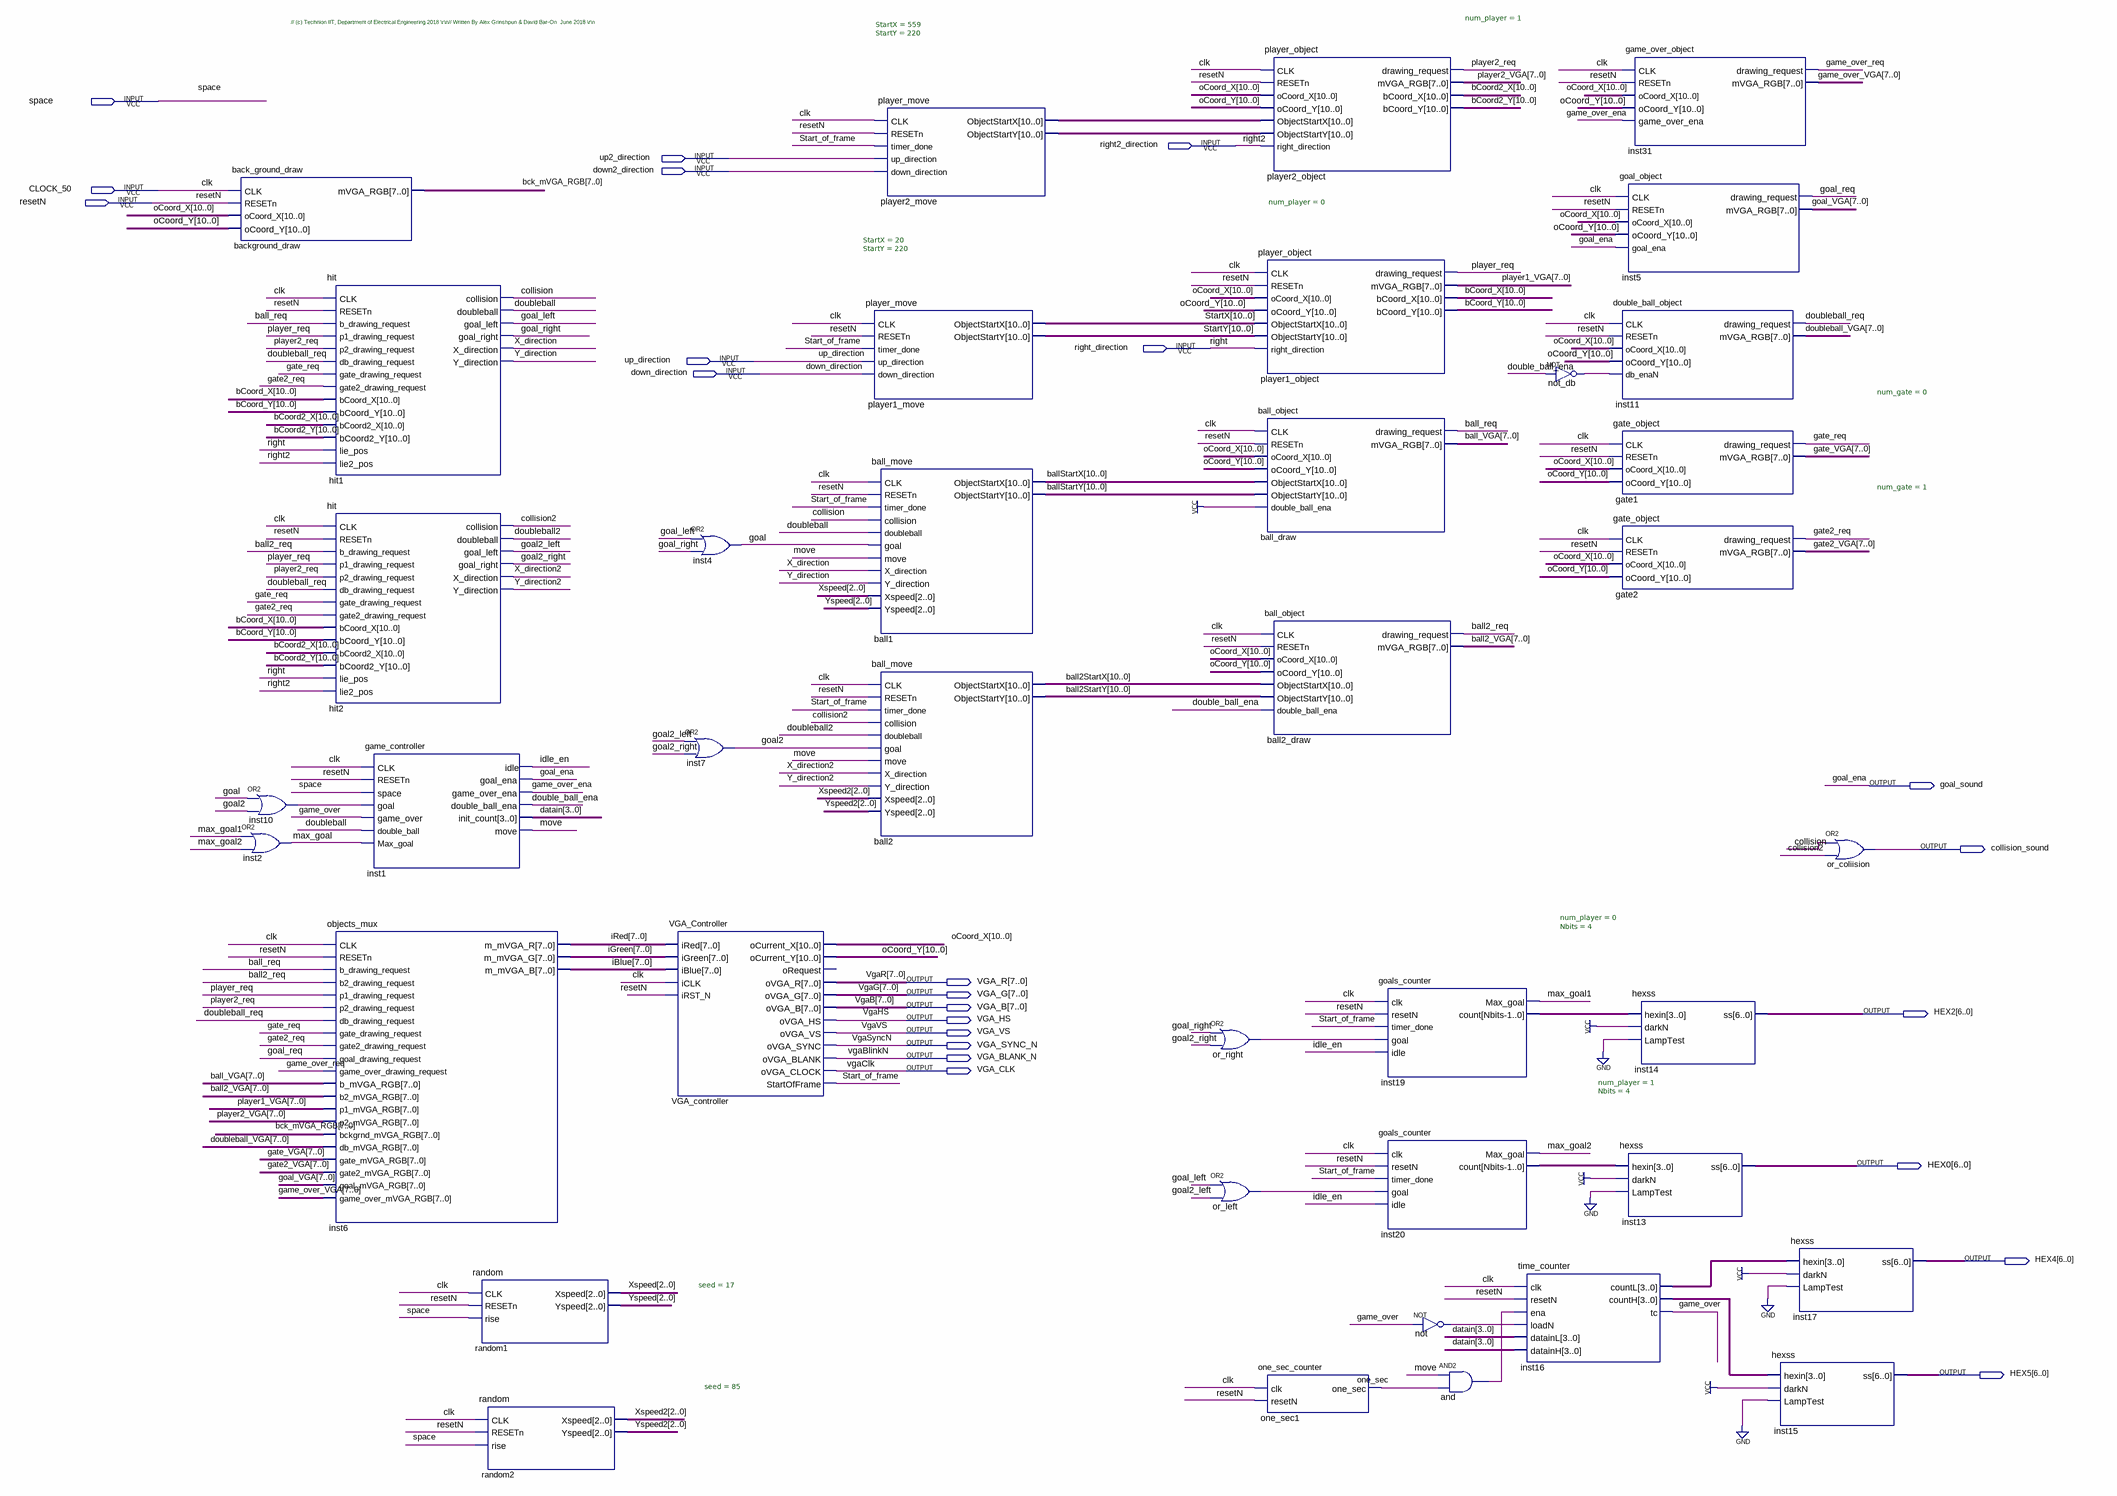
[diagram p0: schematic sheet]
// Quartus schematic TOP_VGA_DEMO.bdf as structural Verilog: 39 symbols, 23 pins
module TOP_VGA_DEMO (
  input  space,
  input  right2_direction,
  input  up2_direction,
  input  down2_direction,
  input  CLOCK_50,
  input  resetN,
  input  right_direction,
  input  up_direction,
  input  down_direction,
  output goal_sound,
  output collision_sound,
  output [7:0] VGA_R,
  output [7:0] VGA_G,
  output [7:0] VGA_B,
  output [6:0] HEX2,
  output VGA_HS,
  output VGA_VS,
  output VGA_SYNC_N,
  output VGA_BLANK_N,
  output VGA_CLK,
  output [6:0] HEX0,
  output [6:0] HEX4,
  output [6:0] HEX5
);

  wire and_out, ball2_req, ball_req, collision, collision2, double_ball_ena, doubleball, doubleball2,
       doubleball_req, game_over, game_over_ena, game_over_req, gate2_req, gate_req, goal, goal2, goal2_left,
       goal2_right, goal_left, goal_req, goal_right, idle_en, inst10_out, max_goal, max_goal1, max_goal2,
       move, not_db_out, not_out, one_sec, or_left_out, or_right_out, player2_req, player_req,
       Start_of_frame, X_direction, X_direction2, Y_direction, Y_direction2;
  wire [2:0] Xspeed, Xspeed2, Yspeed, Yspeed2;
  wire [3:0] datain, inst16_counth, inst16_countl, inst19_count, inst20_count;
  wire [7:0] ball2_VGA, ball_VGA, bck_mVGA_RGB, doubleball_VGA, game_over_VGA, gate2_VGA, gate_VGA, goal_VGA,
       iBlue, iGreen, iRed, player1_VGA, player2_VGA;
  wire [10:0] ball2StartX, ball2StartY, ballStartX, ballStartY, bCoord2_X, bCoord2_Y, bCoord_X, bCoord_Y,
       oCoord_X, oCoord_Y, player2_move_objectstartx, player2_move_objectstarty, StartX, StartY;

  back_ground_draw background_draw (
    .CLK(CLOCK_50), .RESETn(resetN), .oCoord_X(oCoord_X), .oCoord_Y(oCoord_Y), .mVGA_RGB(bck_mVGA_RGB));
  or inst10 (inst10_out, goal, goal2);
  or inst2 (max_goal, max_goal1, max_goal2);
  hit hit1 (
    .CLK(CLOCK_50), .RESETn(resetN), .b_drawing_request(ball_req), .p1_drawing_request(player_req),
    .p2_drawing_request(player2_req), .db_drawing_request(doubleball_req), .gate_drawing_request(gate_req),
    .gate2_drawing_request(gate2_req), .bCoord_X(bCoord_X), .bCoord_Y(bCoord_Y), .bCoord2_X(bCoord2_X),
    .bCoord2_Y(bCoord2_Y), .lie_pos(right_direction), .lie2_pos(right2_direction), .collision(collision),
    .doubleball(doubleball), .goal_left(goal_left), .goal_right(goal_right), .X_direction(X_direction),
    .Y_direction(Y_direction));
  hit hit2 (
    .CLK(CLOCK_50), .RESETn(resetN), .b_drawing_request(ball2_req), .p1_drawing_request(player_req),
    .p2_drawing_request(player2_req), .db_drawing_request(doubleball_req), .gate_drawing_request(gate_req),
    .gate2_drawing_request(gate2_req), .bCoord_X(bCoord_X), .bCoord_Y(bCoord_Y), .bCoord2_X(bCoord2_X),
    .bCoord2_Y(bCoord2_Y), .lie_pos(right_direction), .lie2_pos(right2_direction), .collision(collision2),
    .doubleball(doubleball2), .goal_left(goal2_left), .goal_right(goal2_right), .X_direction(X_direction2),
    .Y_direction(Y_direction2));
  objects_mux inst6 (
    .CLK(CLOCK_50), .RESETn(resetN), .b_drawing_request(ball_req), .b2_drawing_request(ball2_req),
    .p1_drawing_request(player_req), .p2_drawing_request(player2_req), .db_drawing_request(doubleball_req),
    .gate_drawing_request(gate_req), .gate2_drawing_request(gate2_req), .goal_drawing_request(goal_req),
    .game_over_drawing_request(game_over_req), .b_mVGA_RGB(ball_VGA), .b2_mVGA_RGB(ball2_VGA),
    .p1_mVGA_RGB(player1_VGA), .p2_mVGA_RGB(player2_VGA), .bckgrnd_mVGA_RGB(bck_mVGA_RGB),
    .db_mVGA_RGB(doubleball_VGA), .gate_mVGA_RGB(gate_VGA), .gate2_mVGA_RGB(gate2_VGA),
    .goal_mVGA_RGB(goal_VGA), .game_over_mVGA_RGB(game_over_VGA), .m_mVGA_R(iRed), .m_mVGA_G(iGreen),
    .m_mVGA_B(iBlue));
  game_controller inst1 (
    .CLK(CLOCK_50), .RESETn(resetN), .space(space), .goal(inst10_out), .game_over(game_over),
    .double_ball(doubleball), .Max_goal(max_goal), .idle(idle_en), .goal_ena(goal_sound),
    .game_over_ena(game_over_ena), .double_ball_ena(double_ball_ena), .init_count(datain), .move(move));
  random #(.seed(17)) random1 (.CLK(CLOCK_50), .RESETn(resetN), .rise(space), .Xspeed(Xspeed), .Yspeed(Yspeed));
  random #(.seed(85)) random2 (.CLK(CLOCK_50), .RESETn(resetN), .rise(space), .Xspeed(Xspeed2), .Yspeed(Yspeed2));
  or inst4 (goal, goal_left, goal_right);
  or inst7 (goal2, goal2_left, goal2_right);
  VGA_Controller VGA_controller (
    .iRed(iRed), .iGreen(iGreen), .iBlue(iBlue), .iCLK(CLOCK_50), .iRST_N(resetN), .oCurrent_X(oCoord_X),
    .oCurrent_Y(oCoord_Y), .oVGA_R(VGA_R), .oVGA_G(VGA_G), .oVGA_B(VGA_B), .oVGA_HS(VGA_HS),
    .oVGA_VS(VGA_VS), .oVGA_SYNC(VGA_SYNC_N), .oVGA_BLANK(VGA_BLANK_N), .oVGA_CLOCK(VGA_CLK),
    .StartOfFrame(Start_of_frame));  // open: oRequest
  player_move #(.StartX(559), .StartY(220)) player2_move (
    .CLK(CLOCK_50), .RESETn(resetN), .timer_done(Start_of_frame), .up_direction(up2_direction),
    .down_direction(down2_direction), .ObjectStartX(player2_move_objectstartx),
    .ObjectStartY(player2_move_objectstarty));
  player_move #(.StartX(20), .StartY(220)) player1_move (
    .CLK(CLOCK_50), .RESETn(resetN), .timer_done(Start_of_frame), .up_direction(up_direction),
    .down_direction(down_direction), .ObjectStartX(StartX), .ObjectStartY(StartY));
  ball_move ball1 (
    .CLK(CLOCK_50), .RESETn(resetN), .timer_done(Start_of_frame), .collision(collision),
    .doubleball(doubleball), .goal(goal), .move(move), .X_direction(X_direction), .Y_direction(Y_direction),
    .Xspeed(Xspeed), .Yspeed(Yspeed), .ObjectStartX(ballStartX), .ObjectStartY(ballStartY));
  ball_move ball2 (
    .CLK(CLOCK_50), .RESETn(resetN), .timer_done(Start_of_frame), .collision(collision2),
    .doubleball(doubleball2), .goal(goal2), .move(move), .X_direction(X_direction2),
    .Y_direction(Y_direction2), .Xspeed(Xspeed2), .Yspeed(Yspeed2), .ObjectStartX(ball2StartX),
    .ObjectStartY(ball2StartY));
  or or_right (or_right_out, goal_right, goal2_right);
  or or_left (or_left_out, goal_left, goal2_left);
  player_object #(.num_player(1)) player2_object (
    .CLK(CLOCK_50), .RESETn(resetN), .oCoord_X(oCoord_X), .oCoord_Y(oCoord_Y),
    .ObjectStartX(player2_move_objectstartx), .ObjectStartY(player2_move_objectstarty),
    .right_direction(right2_direction), .drawing_request(player2_req), .mVGA_RGB(player2_VGA),
    .bCoord_X(bCoord2_X), .bCoord_Y(bCoord2_Y));
  player_object #(.num_player(0)) player1_object (
    .CLK(CLOCK_50), .RESETn(resetN), .oCoord_X(oCoord_X), .oCoord_Y(oCoord_Y), .ObjectStartX(StartX),
    .ObjectStartY(StartY), .right_direction(right_direction), .drawing_request(player_req),
    .mVGA_RGB(player1_VGA), .bCoord_X(bCoord_X), .bCoord_Y(bCoord_Y));
  ball_object ball_draw (
    .CLK(CLOCK_50), .RESETn(resetN), .oCoord_X(oCoord_X), .oCoord_Y(oCoord_Y), .ObjectStartX(ballStartX),
    .ObjectStartY(ballStartY), .double_ball_ena(1'b1), .drawing_request(ball_req), .mVGA_RGB(ball_VGA));
  ball_object ball2_draw (
    .CLK(CLOCK_50), .RESETn(resetN), .oCoord_X(oCoord_X), .oCoord_Y(oCoord_Y), .ObjectStartX(ball2StartX),
    .ObjectStartY(ball2StartY), .double_ball_ena(double_ball_ena), .drawing_request(ball2_req),
    .mVGA_RGB(ball2_VGA));
  one_sec_counter one_sec1 (.clk(CLOCK_50), .resetN(resetN), .one_sec(one_sec));
  goals_counter #(.num_player(0), .Nbits(4)) inst19 (
    .clk(CLOCK_50), .resetN(resetN), .timer_done(Start_of_frame), .goal(or_right_out), .idle(idle_en),
    .Max_goal(max_goal1), .count(inst19_count));
  goals_counter #(.num_player(1), .Nbits(4)) inst20 (
    .clk(CLOCK_50), .resetN(resetN), .timer_done(Start_of_frame), .goal(or_left_out), .idle(idle_en),
    .Max_goal(max_goal2), .count(inst20_count));
  not \not  (not_out, game_over);
  and \and  (and_out, move, one_sec);
  time_counter inst16 (
    .clk(CLOCK_50), .resetN(resetN), .ena(and_out), .loadN(not_out), .datainL(datain), .datainH(datain),
    .countL(inst16_countl), .countH(inst16_counth), .tc(game_over));
  not not_db (not_db_out, double_ball_ena);
  goal_object inst5 (
    .CLK(CLOCK_50), .RESETn(resetN), .oCoord_X(oCoord_X), .oCoord_Y(oCoord_Y), .goal_ena(goal_sound),
    .drawing_request(goal_req), .mVGA_RGB(goal_VGA));
  double_ball_object inst11 (
    .CLK(CLOCK_50), .RESETn(resetN), .oCoord_X(oCoord_X), .oCoord_Y(oCoord_Y), .db_enaN(not_db_out),
    .drawing_request(doubleball_req), .mVGA_RGB(doubleball_VGA));
  gate_object #(.num_gate(0)) gate1 (
    .CLK(CLOCK_50), .RESETn(resetN), .oCoord_X(oCoord_X), .oCoord_Y(oCoord_Y), .drawing_request(gate_req),
    .mVGA_RGB(gate_VGA));
  gate_object #(.num_gate(1)) gate2 (
    .CLK(CLOCK_50), .RESETn(resetN), .oCoord_X(oCoord_X), .oCoord_Y(oCoord_Y), .drawing_request(gate2_req),
    .mVGA_RGB(gate2_VGA));
  hexss inst13 (.hexin(inst20_count), .darkN(1'b1), .LampTest(1'b0), .ss(HEX0));
  game_over_object inst31 (
    .CLK(CLOCK_50), .RESETn(resetN), .oCoord_X(oCoord_X), .oCoord_Y(oCoord_Y), .game_over_ena(game_over_ena),
    .drawing_request(game_over_req), .mVGA_RGB(game_over_VGA));
  hexss inst14 (.hexin(inst19_count), .darkN(1'b1), .LampTest(1'b0), .ss(HEX2));
  hexss inst15 (.hexin(inst16_counth), .darkN(1'b1), .LampTest(1'b0), .ss(HEX5));
  hexss inst17 (.hexin(inst16_countl), .darkN(1'b1), .LampTest(1'b0), .ss(HEX4));
  or or_coliision (collision_sound, collision, collision2);

  // Other names for the same wires on the sheet: clk = CLOCK_50; goal_ena = goal_sound; right = right_direction;
  //   right2 = right2_direction; VgaB[7:0] = VGA_B; vgaBlinkN = VGA_BLANK_N; vgaClk = VGA_CLK; VgaG[7:0] = VGA_G;
  //   VgaHS = VGA_HS; VgaR[7:0] = VGA_R; VgaSyncN = VGA_SYNC_N; VgaVS = VGA_VS

  // Notes on the sheet:
  //   // (c) Technion IIT, Department of Electrical Engineering 2018 \r\n// Written By Alex Grinshpun & David Bar-On  June 2018 \r\n
endmodule
